# Altium schematic sheet joystick.SchDoc: Joystick
size A3; DrawnBy: Hank Wu, Connor Kwon; Address1: ECE Department; Address2: University of Canterbury; Address3: Christchurch 8041; Address4: New Zealand; Revision: 1
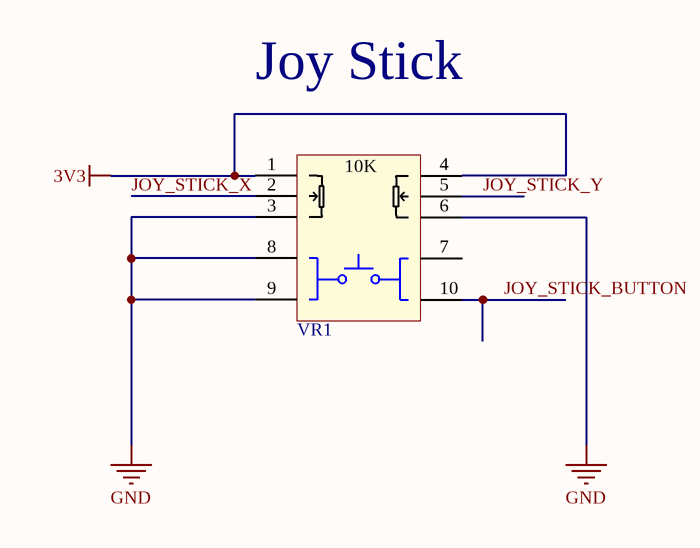
[diagram p0: joystick.SchDoc]

## Parts
VR1  Joystick 10k with Sw  [Joystick_Sw]  (value not drawn)

## Nets
3V3: VR1.1 VR1.4(1')
GND: VR1.3 VR1.6(3') VR1.8 VR1.9
JOY_STICK_BUTTON: VR1.10
JOY_STICK_X: VR1.2
JOY_STICK_Y: VR1.5(2')

Not connected (* = marked no-connect by the designer): VR1 7

## Notes on the sheet
- Joy Stick
- Title
- Drawn by:
- Date:
- Time:
- Revision:
- Sheet
- of
- File:
- (in symbol Joystick 10k with Sw) 10K

## Library data of the parts
VR1 = Joystick 10k with Sw: JOYSTICK 10K OHM 2 AXIS TH; Manufacturer 1: SparkFun; Manufacturer Part Number 1: COM-09032; Supplier 1: Digi-Key; Stock 1: 563; Pricing 1: 1=3.95000 (USD); RoHS: No; ComponentLink1URL: https://media.digikey.com/pdf/Data%20Sheets/Sparkfun%20PDFs/COM-09032_Web.pdf?src-supplier=Digi-Key; ComponentLink1Description: https://media.digikey.com/pdf/Data%20Sheets/Sparkfun%20PDFs/COM-09032_Web.pdf?src-supplier=Digi-Key; Supplier Part Number 1: 1568-1526-ND